# Altium schematic sheet STM32_schematic.SchDoc
size A4; SheetNumber: 2; SheetTotal: 2
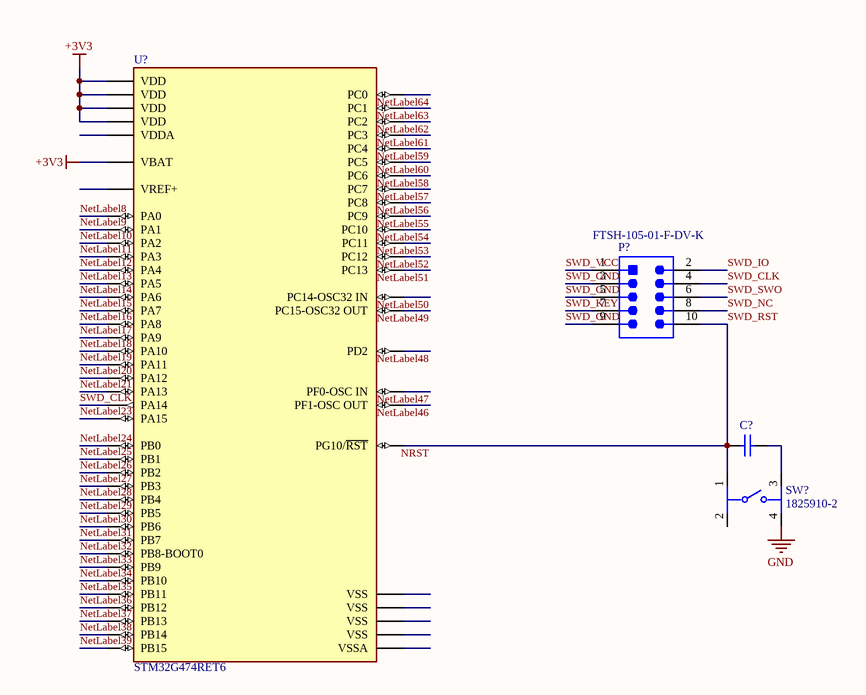
[diagram p0: STM32_schematic.SchDoc]

## Parts
C?  VJ0603Y104JXXAC  [CAPC1608X92X38NL15T08]  (value not drawn)
P?  FTSH-105-01-F-DV-K  [SMTC-FTSH-105-01-L-DV-K_V]
SW?  1825910-2  [FP-1825910-2-0]
U?  STM32G474RET6  [FP-LQFP64-5W-MFG]

## Nets
+3V3: U?.1(VBAT) U?.16(VDD) U?.32(VDD) U?.48(VDD) U?.64(VDD)
GND: SW?.4
NetLabel8: U?.12(PA0)
NetLabel9: U?.13(PA1)
NetLabel10: U?.14(PA2)
NetLabel11: U?.17(PA3)
NetLabel12: U?.18(PA4)
NetLabel13: U?.19(PA5)
NetLabel14: U?.20(PA6)
NetLabel15: U?.21(PA7)
NetLabel16: U?.42(PA8)
NetLabel17: U?.43(PA9)
NetLabel18: U?.44(PA10)
NetLabel19: U?.45(PA11)
NetLabel20: U?.46(PA12)
NetLabel21: U?.49(PA13)
NetLabel23: U?.51(PA15)
NetLabel24: U?.24(PB0)
NetLabel25: U?.25(PB1)
NetLabel26: U?.26(PB2)
NetLabel27: U?.56(PB3)
NetLabel28: U?.57(PB4)
NetLabel29: U?.58(PB5)
NetLabel30: U?.59(PB6)
NetLabel31: U?.60(PB7)
NetLabel32: U?.61(PB8-BOOT0)
NetLabel33: U?.62(PB9)
NetLabel34: U?.30(PB10)
NetLabel35: U?.33(PB11)
NetLabel36: U?.34(PB12)
NetLabel37: U?.35(PB13)
NetLabel38: U?.36(PB14)
NetLabel39: U?.37(PB15)
NetLabel46: U?.6(PF1-OSC_OUT)
NetLabel47: U?.5(PF0-OSC_IN)
NetLabel48: U?.55(PD2)
NetLabel49: U?.4(PC15-OSC32_OUT)
NetLabel50: U?.3(PC14-OSC32_IN)
NetLabel51: U?.2(PC13)
NetLabel52: U?.54(PC12)
NetLabel53: U?.53(PC11)
NetLabel54: U?.52(PC10)
NetLabel55: U?.41(PC9)
NetLabel56: U?.40(PC8)
NetLabel57: U?.39(PC7)
NetLabel58: U?.38(PC6)
NetLabel59: U?.22(PC4)
NetLabel60: U?.23(PC5)
NetLabel61: U?.11(PC3)
NetLabel62: U?.10(PC2)
NetLabel63: U?.9(PC1)
NetLabel64: U?.8(PC0)
NRST: C?.1 P?.10 SW?.1 U?.7(PG10/~{RST})  [also labelled SWD_RST]
SWD_CLK: P?.4 U?.50(PA14)
SWD_GND: P?.3 P?.5 P?.9
SWD_IO: P?.2
SWD_KEY: P?.7
SWD_NC: P?.8
SWD_SWO: P?.6
SWD_VCC: P?.1
NetC?_2: C?.2 SW?.3

Not connected (* = marked no-connect by the designer): SW? 2; U? 15(VSS) 27(VSSA) 28(VREF+) 29(VDDA) 31(VSS) 47(VSS) 63(VSS)

## Library data of the parts
C? = CMP-2006-01210-1: Manufacturer: Vitramon; Part Number: VJ0603Y104JXXAC
P? = CMP-2000-05352-1: Male Header, Pitch 1.27 mm, 2 x 5 Position, Height 6.12 mm, RoHS, Tube; Manufacturer: Samtec; Number of Positions: 10; Connector Type: Header,Shrouded; Number of Positions Loaded: All; Row Spacing: 0.050"(1.27mm); Fastening Type: -; Package Reference: FTSH-105-01-L-DV-K; Termination: Solder; Package URL: http://suddendocs.samtec.com/prints/ftsh-1xx-xx-xxx-dv-xxx-footprint.pdf; Number of Rows: 2; Contact Finish Thickness: 3µin(0.08µm); Contact Type: MalePin; Manufacturer URL: http://www.samtec.com/; Contact Mating Length: 0.120"(3.05mm); Pitch: 0.050"(1.27mm); Series: FTSH; Features: -; Contact Finish: Gold; Color: Black; Family: RectangularConnectors-Headers,MalePins; Datasheet URL: http://suddendocs.samtec.com/prints/ftsh-1xx-xx-xxx-dv-xxx-mkt.pdf; Package Description: Male Header, Pitch 1.27 mm, 2 x 5 Position, Height 5.97 mm, Tail Length 4.32 mm; Mounting Type: SurfaceMount; Datasheet Version: Rev. ET, 10/1995; Category: Connectors,Interconnects; Packaging: Tube
SW? = CMP-03407-000004-1: SWITCH TACTILE SPST-NO 0.05A 24V; Manufacturer: TE; Contact Current Rating: 50mA; Description: Switch Tactile Round Button PC Pins 0.05A 24VDC 100000Cycle 1.56N Thru-Hole; Operating Force: 160gf; Contact Resistance: 100mΩ; Electromechanical Life: 100000Cycles; Package: 0; ComponentLink2Description: Datasheet; Digikey Description: SWITCH TACTILE SPST-NO 0.05A 24V; Octopart: https://octopart.com/1825910-2-te+connectivity-42270502; Temperature Range Low: -35°C; Temperature Range High: +85°C; Lead Free: Yes; Device Class L2: Switches; Automotive: No; Temperature: -35°C to +85°C; Device Class L1: Electromechanical; Category: Switch; ComponentLink2URL: https://www.te.com/commerce/DocumentDelivery/DDEController?Action=showdoc&DocId=Customer+Drawing%7F1825910%7FC10%7Fpdf%7FEnglish%7FENG_CD_1825910_C10.pdf%7F1825910-2; Mount: Through Hole; RoHS: TRUE; Height: 4.6mm; Manufacturer Part Number: 1825910-2; Device Class L3: Tactile Switches; Voltage Rating Dc: 24V; Throw Configuration: SPST-NO
U? = CMP-12105-000051-1: MAINSTREAM ARM CORTEX-M4 CORE WI; Manufacturer: STMicroelectronics; Ram Size: 128KBytes; Interface: I2C,SPI,UART,USART,CAN,USB,LIN,IrDA,I2S,SMBus,Other; Number Of I2C Channels: 4; Number Of A/D Converters: 5; Number Of Timers/Counters: 14; Number Of I/Os: 52; Max Supply Voltage: 3.6V; Memory Size: 512KBytes; Number Of Adc Channels: 26; Description: ARM® Cortex®-M4F STM32G4 Microcontroller IC 32-Bit 170MHz 512KB (512K x 8) FLASH 64-LQFP (10x10); Number Of Cores: 1; Min Supply Voltage: 1.71V; Max Junction Temp: +105°C; Standoff Height: 0.05mm; Number Of Uart Channels: 6; Number Of Spi Channels: 3; Frequency: 170MHz; Data Bus Width: 32bits; Memory Type: FLASH; Number Of Pwm Channels: 32; Package: LQFP64-5W; Manufacturer Part Number: STM32G474RET6; Height: 1.6mm; Mouser Description: Microcontroller 32-Bit ARM Cortex-M4 RISC 512KB Flash 1.71V to 3.6V 64-Pin LQFP; Temperature Range High: +105°C; Octopart: https://octopart.com/stm32g474ret6-stmicroelectronics-102308483; Category: IC; Automotive: No; ComponentLink2URL: https://www.st.com/resource/en/datasheet/stm32g474cb.pdf; Temperature Range Low: -40°C; Device Class L1: Integrated Circuits (ICs); Device Class L2: Embedded Processors and Controllers; Core Architecture: ARM Cortex-M4; Ambient Temperature Range Low: -40°C; ComponentLink2Description: Datasheet; Temperature: -40°C to +105°C; Digikey Description: MAINSTREAM ARM CORTEX-M4 CORE WI; Lead Free: Yes; RoHS: TRUE; Ambient Temperature Range High: +85°C; Device Class L3: Microcontrollers; Number Of Usb Channels: 1